# Altium schematic sheet Pyro Channel.SchDoc
size A4; SheetNumber: 6; SheetTotal: 6
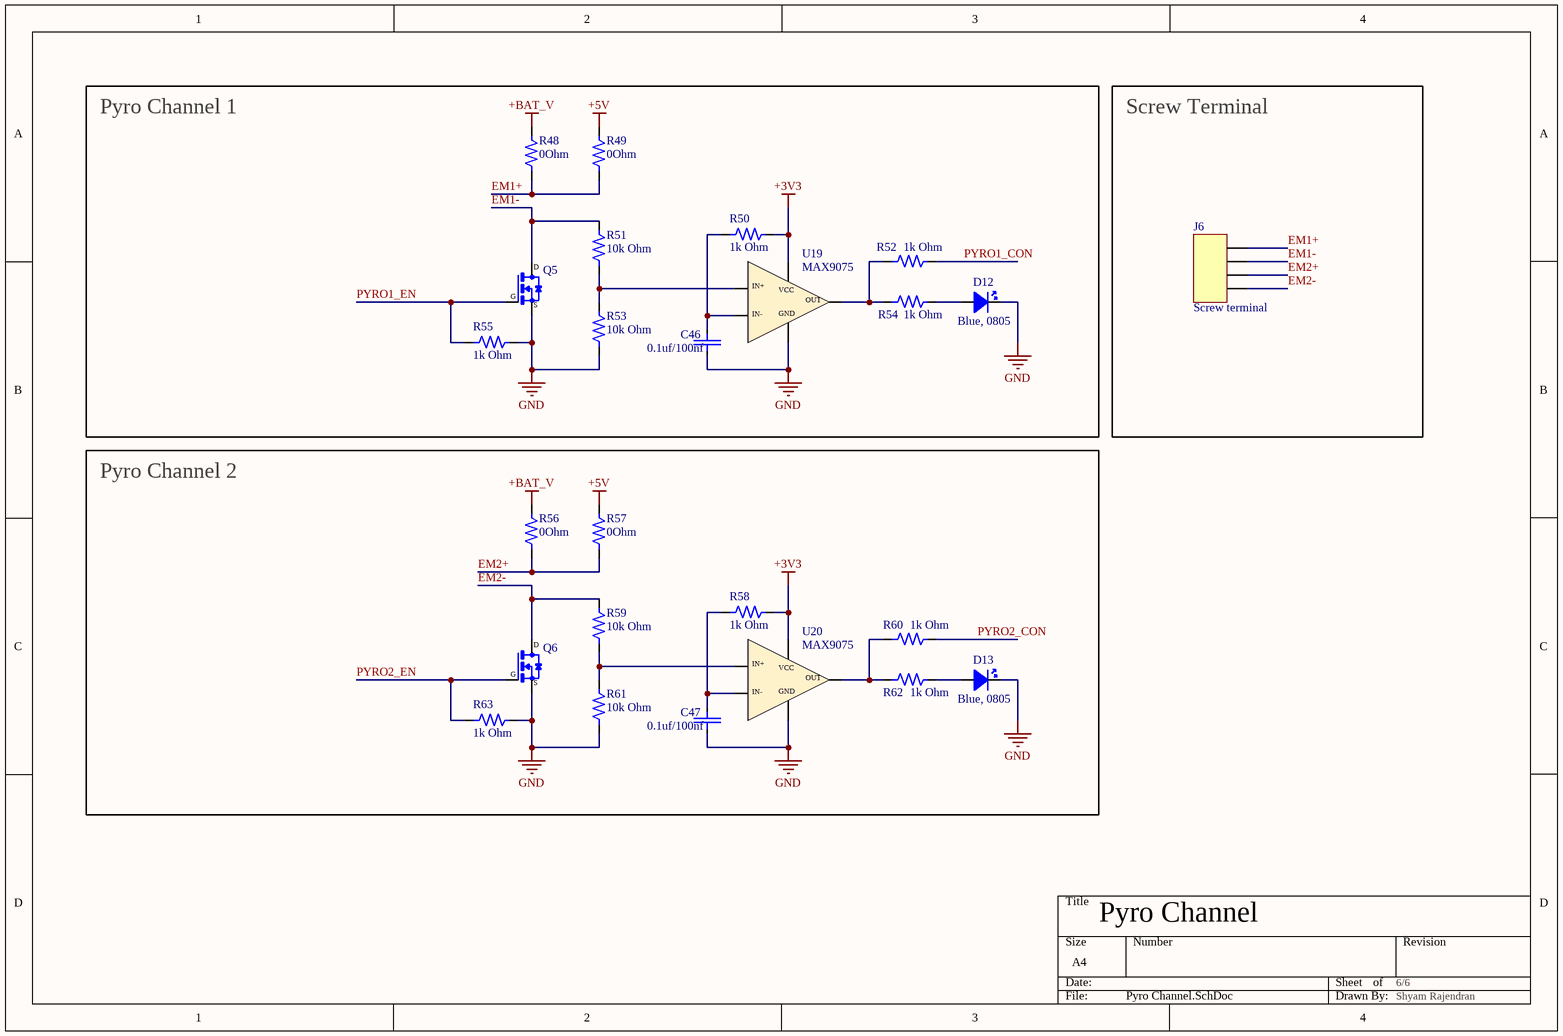
[diagram p0: Pyro Channel.SchDoc]

## Parts
C46  0.1uf/100nf  [0.1uF Capacitor]
C47  0.1uf/100nf  [0.1uF Capacitor]
D12  Blue, 0805  [led blue]
D13  Blue, 0805  [led blue]
J6  Screw terminal  [Screw terminal]
Q5  WNM2021  [P Mosfet SL2P10A]  (value not drawn)
Q6  WNM2021  [P Mosfet SL2P10A]  (value not drawn)
R48  0Ohm  [1k 0805 Resistor]
R49  0Ohm  [1k 0805 Resistor]
R50  1k Ohm  [1k 0805 Resistor]
R51  10k Ohm  [RESC2013X60X35ML10T20]
R52  1k Ohm  [1k 0805 Resistor]
R53  10k Ohm  [RESC2013X60X35ML10T20]
R54  1k Ohm  [1k 0805 Resistor]
R55  1k Ohm  [1k 0805 Resistor]
R56  0Ohm  [1k 0805 Resistor]
R57  0Ohm  [1k 0805 Resistor]
R58  1k Ohm  [1k 0805 Resistor]
R59  10k Ohm  [RESC2013X60X35ML10T20]
R60  1k Ohm  [1k 0805 Resistor]
R61  10k Ohm  [RESC2013X60X35ML10T20]
R62  1k Ohm  [1k 0805 Resistor]
R63  1k Ohm  [1k 0805 Resistor]
U19  MAX9075  [Comparator MAX9075]
U20  MAX9075  [Comparator MAX9075]

## Blocks framed on the sheet
Pyro Channel 1: C46 D12 Q5 R48-R55 U19
Screw Terminal: J6
Pyro Channel 2: C47 D13 Q6 R56-R63 U20

## Nets
+3V3: R50.2 R58.2 U19.VCC U20.VCC
+5V: R49.2 R57.2
+BAT_V: R48.2 R56.2
GND: C46.1 C47.1 D12.C D13.C Q5.S Q6.S R53.1 R55.2 R61.1 R63.2 U19.GND U20.GND
EM1+: J6.1 R48.1 R49.1
EM1-: J6.2 Q5.D R51.2
EM2+: J6.3 R56.1 R57.1
EM2-: J6.4 Q6.D R59.2
PYRO1_CON: R52.2
PYRO1_EN: Q5.G R55.1
PYRO2_CON: R60.2
PYRO2_EN: Q6.G R63.1
NetC46_2: C46.2 R50.1 U19.IN-
NetC47_2: C47.2 R58.1 U20.IN-
NetD12_A: D12.A R54.2
NetD13_A: D13.A R62.2
NetR51_1: R51.1 R53.2 U19.IN+
NetR52_1: R52.1 R54.1 U19.OUT
NetR59_1: R59.1 R61.2 U20.IN+
NetR60_1: R60.1 R62.1 U20.OUT

## Notes on the sheet
- Pyro Channel <BMP280>
- 6/6 <BMP280>
- Shyam Rajendran <BMP280>

## Library data of the parts
C46 C47 = CC0805KRX7R9BB104: 0.1 uF, Multilayer Ceramic Capacitor, 50 V, ï¿½ 10%, X7R, 0805 [2012 Metric]; Manufacturer: Yageo; Value: 100nF; Voltage Rating: 50V; Insulation Resistance: 100GR; Supplier: Future Electronics; Supplier Part Number: 2986263; Manufacturer Part Number: CC0805KRX7R9BB104; RoHS: Yes; Category: Ceramic Capacitors; Stock: 2884000; Pricing: 4000=0.009, 12000=0.0088, 40000=0.0085, 80000=0.0083, 160000=0.008 (USD); Mounting Technology: Surface Mount; Case/Package: 0805; Pins: 2; Case Code (Metric): 2012; Case Code (Imperial): 0805; Material: Ceramic; Min Operating Temperature: -55°C; Max Operating Temperature: 125°C; Packaging: Tape and Reel; Tolerance: 10%; Dielectric: X7R; Series: CC; Package Quantity: 4000; Voltage: 50V; Termination: SMD/SMT; Length: 2mm; Height: 0.85mm; Depth: 1.25mm; Radiation Hardening: No; RoHS Compliant: Yes; Lead Free: 5697LeadFree; Reach SVHC Compliant: No; Halogen Free: 5694HalogenFree
D12 D13 = LED Blue
J6 = screw terminal: 5.08 pitch
Q5 Q6 = N Mosfet: WNM2021-Slkor-20V 2.3A 86mΩ@2.5V,1A 200mW 1.2V 1 N-channel SOT-323 MOSFETs ROHS; MF: Vishay Siliconix; MP: SI2323DS-T1-E3; SnapEDA_Link: https://www.snapeda.com/parts/SI2323DS-T1-E3/Vishay/view-part/?ref=snap; Package: SOT-23-3 Vishay Siliconix; Value: *; Check_prices: https://www.snapeda.com/parts/SI2323DS-T1-E3/Vishay/view-part/?ref=eda
R48 R49 R56 R57 = CRCW08050000Z0EA: 0 Ohm Resistor, Jumper, 0805 [2012 Metric], Thick Film, 125 mW, Surface Mount; Manufacturer: Vishay; Value: 0mR; Power Rating: 125mW; Temperature Coefficient: 100ppm/°C; Voltage Rating: 150V; Tolerance: 1%; Supplier: Arrow Electronics; Supplier Part Number: CRCW08050000Z0EA; Manufacturer Part Number: CRCW08050000Z0EA; RoHS: Yes; Category: Chip SMD Resistors; Stock: 1390000; Pricing: 5000=0.0051, 10000=0.005, 15000=0.0049, 25000=0.0045 (USD); Case/Package: 0805; Case Code (Imperial): 0805; Case Code (Metric): 2012; Contact Plating: Tin; Weight: 0.000194oz; Min Operating Temperature: -55°C; Max Operating Temperature: 155°C; Packaging: Tape and Reel; Series: CRCW; Number of Terminations: 2; Resistor Type: Thick Film; Termination: SMD/SMT; Max Power Dissipation: 125mW; Package Quantity: 1; Features: Automotive AEC-Q200; Construction: Rectangular; Technology: THICK FILM; Voltage Rating (DC): 150V; Resistance Tolerance: 1%; Length: 2mm; Width: 0.049inch; Height: 0.45mm; Depth: 1.25mm; Radiation Hardening: No; RoHS Compliant: Yes; Military Standard: Not; Reach SVHC Compliant: Unknown; Lead Free: 5697LeadFree; ComponentLink1URL: https://datasheet.ciiva.com/11811/0900766b80d98b26-11811304.pdf?src-supplier=Rs; ComponentLink1Description: https://datasheet.ciiva.com/11811/0900766b80d98b26-11811304.pdf?src-supplier=Rs; ComponentLink2URL: https://datasheet.ciiva.com/7841/1720486-7841839.pdf?src-supplier=Element14; ComponentLink2Description: https://datasheet.ciiva.com/7841/1720486-7841839.pdf?src-supplier=Element14; ComponentLink3URL: https://datasheet.ciiva.com/26314/fld-crcw-e3-data-en-26314630.pdf?src-supplier=Distrelec; ComponentLink3Description: https://datasheet.ciiva.com/26314/fld-crcw-e3-data-en-26314630.pdf?src-supplier=Distrelec; ComponentLink4URL: https://datasheet.ciiva.com/7841/1697337-7841629.pdf?src-supplier=Element14; ComponentLink4Description: https://datasheet.ciiva.com/7841/1697337-7841629.pdf?src-supplier=Element14; ComponentLink5URL: https://datasheet.ciiva.com/2463/dcrcwe3-2463038.pdf?src-supplier=Digikey; ComponentLink5Description: https://datasheet.ciiva.com/2463/dcrcwe3-2463038.pdf?src-supplier=Digikey; ComponentLink6URL: https://datasheet.ciiva.com/2463/dcrcwe3-2463039.pdf?src-supplier=Digikey; ComponentLink6Description: https://datasheet.ciiva.com/2463/dcrcwe3-2463039.pdf?src-supplier=Digikey; ComponentLink7URL: https://datasheet.ciiva.com/2463/dcrcwe3-2463037.pdf?src-supplier=Digikey; ComponentLink7Description: https://datasheet.ciiva.com/2463/dcrcwe3-2463037.pdf?src-supplier=Digikey; ComponentLink8URL: https://datasheet.ciiva.com/16719/70201119-16719706.pdf?src-supplier=Allied+Electronics; ComponentLink8Description: https://datasheet.ciiva.com/16719/70201119-16719706.pdf?src-supplier=Allied+Electronics; ComponentLink9URL: https://datasheet.ciiva.com/5543/dcrcwe3-109170-5543096.pdf?src-supplier=Mouser; ComponentLink9Description: https://datasheet.ciiva.com/5543/dcrcwe3-109170-5543096.pdf?src-supplier=Mouser; ComponentLink10URL: https://datasheet.ciiva.com/16389/dcrcwe3-16389338.pdf?src-supplier=Future+Electronics; ComponentLink10Description: https://datasheet.ciiva.com/16389/dcrcwe3-16389338.pdf?src-supplier=Future+Electronics
R50 R52 R54 R55 R58 R60 R62 R63 = RC0805FR-071KL: 1k Ohm, 0805, SMD Chip Resistor , ï¿½ 1%, 125 mW,[2012 Metric], Thick Film, General Purpose; Manufacturer: Yageo; Value: 1kR; Power Rating: 125mW; Voltage Rating: 150V; Temperature Coefficient: 100ppm/°C; Supplier: Future Electronics; Supplier Part Number: 8126013; Manufacturer Part Number: RC0805FR-071KL; RoHS: Yes; Category: Chip SMD Resistors; Stock: 5450000; Pricing: 5000=0.0021, 20000=0.002, 100000=0.0019, 200000=0.0018, 625000=0.0017 (USD); Case/Package: 0805; Pins: 2; Case Code (Metric): 2012; Case Code (Imperial): 0805; Min Operating Temperature: -55°C; Max Operating Temperature: 155°C; Tolerance: 1%; Packaging: Tape and Reel; Voltage Rating (DC): 150V; Resistor Type: Thick Film; Series: RC; Number of Terminations: 2; Termination: SMD/SMT; Max Power Dissipation: 125mW; Resistance Tolerance: 1%; Package Quantity: 1; Features: Moisture Resistant; Construction: Rectangular; Voltage Rating (AC): 150V; Length: 0.079inch; Width: 0.049inch; Height: 0.024inch; Depth: 1.25mm; RoHS Compliant: Yes; Reach SVHC Compliant: No; Military Standard: Not; Lead Free: Lead Free
R51 R53 R59 R61 = RC0805FR-0710KL: 10 kOhm, SMD Chip Resistor, ï¿½ 1%, 125 mW, 0805 [2012 Metric], Thick Film, General Purpose; Manufacturer: Yageo; Value: 10kR; Power Rating: 125mW; Voltage Rating: 150V; Temperature Coefficient: 100ppm/°C; Supplier: Future Electronics; Supplier Part Number: 3310877; Manufacturer Part Number: RC0805FR-0710KL; RoHS: Yes; Category: Chip SMD Resistors; Stock: 15945000; Pricing: 5000=0.0021, 20000=0.002, 100000=0.0019, 200000=0.0018, 625000=0.0017 (USD); Case/Package: 0805; Case Code (Imperial): 0805; Case Code (Metric): 2012; Min Operating Temperature: -55°C; Max Operating Temperature: 155°C; Packaging: Tape and Reel; Tolerance: 1%; Termination: SMD/SMT; Number of Terminations: 2; Max Power Dissipation: 125mW; Features: Moisture Resistant; Series: RC; Resistor Type: Thick Film; Construction: Rectangular; Resistance Tolerance: 1%; Package Quantity: 1; Technology: THICK FILM; Voltage Rating (AC): 150V; Length: 0.079inch; Width: 0.049inch; Height: 0.024inch; Depth: 1.25mm; Lead Free: Lead Free; RoHS Compliant: Yes; Military Standard: Not; Reach SVHC Compliant: Unknown; ComponentLink1URL: https://datasheet.ciiva.com/11808/0900766b8106beab-11808151.pdf?src-supplier=Rs; ComponentLink1Description: https://datasheet.ciiva.com/11808/0900766b8106beab-11808151.pdf?src-supplier=Rs; ComponentLink2URL: https://datasheet.ciiva.com/46447/444164-46447563.pdf?src-supplier=Element14; ComponentLink2Description: https://datasheet.ciiva.com/46447/444164-46447563.pdf?src-supplier=Element14; ComponentLink3URL: https://datasheet.ciiva.com/2456/pyu-r-int-thick-7-2456973.pdf?src-supplier=Digikey; ComponentLink3Description: https://datasheet.ciiva.com/2456/pyu-r-int-thick-7-2456973.pdf?src-supplier=Digikey; ComponentLink4URL: https://datasheet.ciiva.com/2456/pyu-r-int-thick-7-2456974.pdf?src-supplier=Digikey; ComponentLink4Description: https://datasheet.ciiva.com/2456/pyu-r-int-thick-7-2456974.pdf?src-supplier=Digikey; ComponentLink5URL: https://datasheet.ciiva.com/2456/pyu-r-int-thick-7-2456972.pdf?src-supplier=Digikey; ComponentLink5Description: https://datasheet.ciiva.com/2456/pyu-r-int-thick-7-2456972.pdf?src-supplier=Digikey; ComponentLink6URL: https://datasheet.ciiva.com/12669/rc0805-12669688.pdf?src-supplier=Mouser; ComponentLink6Description: https://datasheet.ciiva.com/12669/rc0805-12669688.pdf?src-supplier=Mouser; ComponentLink7URL: https://datasheet.ciiva.com/16747/rc0805-16747087.pdf?src-supplier=Future+Electronics; ComponentLink7Description: https://datasheet.ciiva.com/16747/rc0805-16747087.pdf?src-supplier=Future+Electronics
U19 U20 = Comparator MAX9075: Comparator MAX9075 SOT23-5